# Altium project STM32F407_Board.PrjPcb
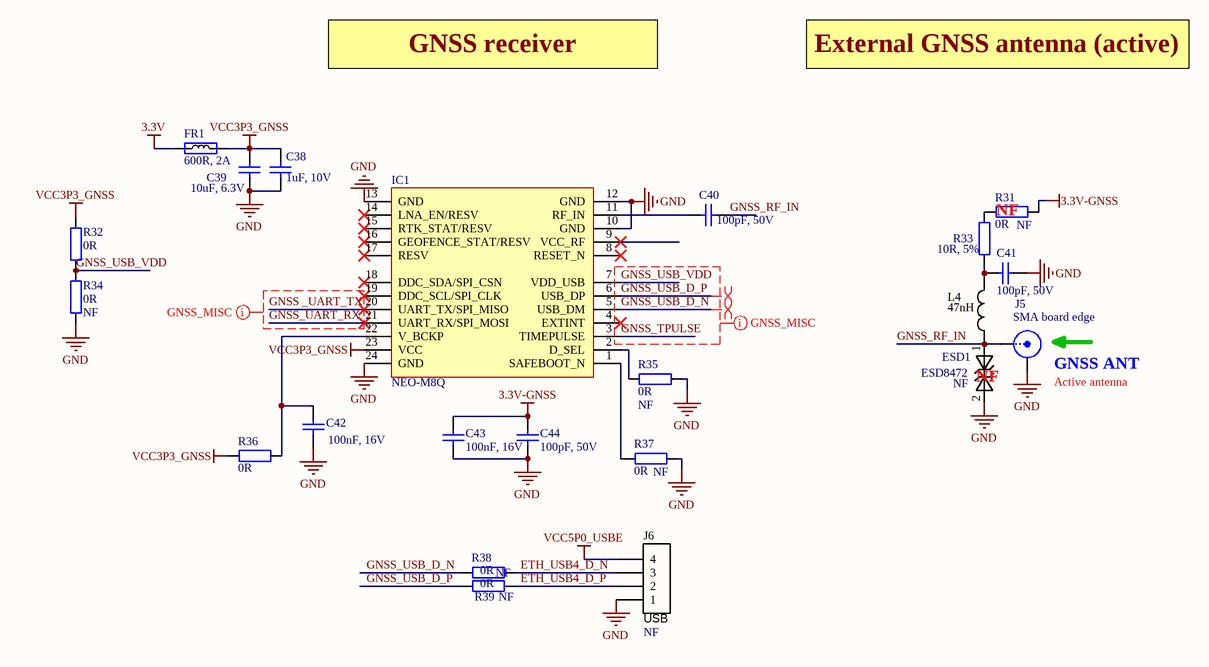
[diagram p0: GNSS-receiver.SchDoc]
5 sheets, 80 parts. Net scope: global (net labels, ports and power ports of the same name join across sheets).
Board file: CORE-XY.PcbDoc
Sheets:
  GNSS-receiver.SchDoc
  sensors.SchDoc
  INTERFACE-COMMUNICATION.SchDoc
  LORA-MODULE.SchDoc
  DAC4-20mA-ADC-0-10V.SchDoc

## Sheet GNSS-receiver.SchDoc
size A4

### Parts
C38  1uF, 10V  [CAP0402]
C39  10uF, 6.3V  [CAP0603]
C40  100pF, 50V  [CAP0402]
C41  100pF, 50V  [CAP0402]
C42  100nF, 16V  [CAP0402]
C43  100nF, 16V  [CAP0402]
C44  100pF, 50V  [CAP0402]
ESD1  ESD8472  Assembly Info: NF  [ESD8472_X3DFN2]
FR1  600R, 2A  [RES0805]
IC1  NEO-M8Q  [NEO-7M/8M]
J5  SMA board edge  [SMA_connector_board_edge_SM]
J6  USB  Assembly Info: NF  [HEADER4X1_TH]
L4  47nH  [RES0402]
R31  0R  Assembly Info: NF  [RES0402]
R32  0R  [RES0402]
R33  10R, 5%  [RES0402]
R34  0R  Assembly Info: NF  [RES0402]
R35  0R  Assembly Info: NF  [RES0402]
R36  0R  [RES0402]
R37  0R  Assembly Info: NF  [RES0402]
R38  0R  Assembly Info: NF  [RES0402]
R39  0R  Assembly Info: NF  [RES0402]

### Nets
3.3V: FR1.1
3.3V-GNSS: C43.2 C44.1 R31.1
GND: C38.1 C39.1 C41.2 C42.2 C43.1 C44.2 ESD1.2 IC1.10(GND) IC1.12(GND) IC1.13(GND) IC1.24(GND) J5.2(Y) J6.1 R34.2 R35.2 R37.1
VCC3P3_GNSS: C38.2 C39.2 FR1.2 IC1.23(VCC) R32.2 R36.2
VCC5P0_USBE: J6.4
ETH_USB4_D_N: J6.3 R38.1
ETH_USB4_D_P: J6.2 R39.1
GNSS _UART_TX: IC1.20(UART_TX/SPI_MISO)
GNSS_RF_IN: C40.1 ESD1.1 J5.1(X) L4.1
GNSS_TPULSE: IC1.3(TIMEPULSE)
GNSS_UART_RX: IC1.21(UART_RX/SPI_MOSI)
GNSS_USB_D_N: IC1.5(USB_DM) R38.2
GNSS_USB_D_P: IC1.6(USB_DP) R39.2
GNSS_USB_VDD: IC1.7(VDD_USB) R32.1 R34.1
NetC40_2: C40.2 IC1.11(RF_IN)
NetC41_1: C41.1 L4.2 R33.2
NetC42_1: C42.1 IC1.22(V_BCKP) R36.1
NetIC1_1: IC1.1(SAFEBOOT_N) R37.2
NetIC1_2: IC1.2(D_SEL) R35.1
NetR31_2: R31.2 R33.1

Not connected (* = marked no-connect by the designer): IC1 4(EXTINT)* 8(RESET_N)* 9(VCC_RF)* 14(LNA_EN/RESV)* 15(RTK_STAT/RESV)* 16(GEOFENCE_STAT/RESV)* 17(RESV)* 18(DDC_SDA/SPI_CSN)* 19(DDC_SCL/SPI_CLK)*

### Layout directives
differential pair: GNSS_USB_D_N, GNSS_USB_D_P
net class GNSS_MISC: GNSS _UART_TX, GNSS_TPULSE, GNSS_UART_RX, GNSS_USB_D_N, GNSS_USB_D_P, GNSS_USB_VDD

### Notes on the sheet
- GNSS receiver
- External GNSS antenna (active)
- NF
- (near ESD1) NF
- (near J5) GNSS ANT
- (near J5) Active antenna

### Library data of the parts
C38 = Cap_0402: CAP CER 1UF 10V X5R 0402; Manufacturer: Yageo; Part Description: 1µF 10V Ceramic Capacitor X5R 0402 (1005 Metric) 0.039" L x 0.020" W (1.00mm x 0.50mm); Manufacturer Part Number 1: CC0402MRX5R6BB105; Notification: Current market demand for these product types have resulted in fluctuating and extending lead times. Lead times may differ.; Tolerance: ±20%; Value: 1uF, 10V; Supplier 1: Digi-Key; Supplier Part Number 1: 311-1732-1-ND; RoHS: RoHS Compliant; Applications: General Purpose; Category: Capacitors; ComponentLink1Description: http://www.yageo.com/documents/recent/UPY-GPHC_X5R_4V-to-50V_25.pdf; ComponentLink1URL: http://www.yageo.com/documents/recent/UPY-GPHC_X5R_4V-to-50V_25.pdf; Failure Rate: -; Features: -; Height - Seated (Max): -; Lead Spacing: -; Lead Style: -; Mounting Type: Surface Mount, MLCC; Operating Temperature: -55°C ~ 85°C; Package / Case: 0402 (1005 Metric); Packaging: Cut Tape (CT); Part Status: Active; Pricing 1: 1=0.22, 10=0.156, 100=0.0732, 500=0.0513, 1000=0.04248, 2500=0.03953, 5000=0.03617 (USD); Ratings: -; Size / Dimension: 0.039" L x 0.020" W (1.00mm x 0.50mm); Stock 1: 69600; Temperature Coefficient: X5R; Thickness (Max): 0.022" (0.55mm); Voltage - Rated: 10V
C39 = Cap_0603: Manufacturer Part Number 1: CC0603MRX5R5BB106; Manufacturer: Yageo; Part Description: 10µF ±20% 6.3V X5R Ceramic Capacitor -55°C ~ 85°C Surface Mount, MLCC 0603 (1608 Metric) 0.063" L x 0.031" W (1.60mm x 0.80mm); Capacitance: 10µF; Tolerance: ±20%; Supplier 1: Digi-Key; Supplier Part Number 1: 311-1448-2-ND; Package / Case: 0603 (1608 Metric); Category: Capacitors; Voltage - Rated: 6.3V; Value: 10uF, 6.3V
C40 C41 C44 = Cap_0402: Manufacturer Part Number 1: CC0402JRNPO9BN101; Manufacturer: Yageo; Part Description: 100pF ±5% 50V C0G, NP0 Ceramic Capacitor -55°C ~ 125°C Surface Mount, MLCC 0402 (1005 Metric) 0.039" L x 0.020" W (1.00mm x 0.50mm); Tolerance: ±5%; Temperature Coefficient: C0G, NP0; Value: 100pF, 50V; Capacitance: 100pF; Thickness (Max): 0.022" (0.55mm); Size / Dimension: 0.039" L x 0.020" W (1.00mm x 0.50mm); RoHS: RoHS Compliant; Ratings: -; Package / Case: 0402 (1005 Metric); Mounting Type: Surface Mount, MLCC; Height - Seated (Max): -; Features: -; Lead Spacing: -; Voltage - Rated: 50V; Operating Temperature: -55°C ~ 125°C; Packaging: Cut Tape (CT); Applications: General Purpose; Lead Style: -; Supplier 1: Digi-Key; Category: Capacitors; Supplier Part Number 1: 311-1024-1-ND
C42 = Cap_0603: Manufacturer Part Number 1: GRM155R71C104KA88D; Part Description: CAP CER 0.1UF 16V X7R 0402; Brand: Murata Electronics; Tolerance: 10 %; Type: General Purpose MLCC; Capacitance: 0.1 uF; Temperature Coefficient / Code: +/- 15 %; Case Height: 0.5 mm; Case Length: 1 mm; Dielectric: X7R; Supplier 1: Mouser; Supplier Part Number 1: 81-GRM155R71C104KA88; Case Code - in: 0402; Manufacturer: Murata Electronics; Category: Multilayer Ceramic Capacitors MLCC - SMD/SMT; Voltage Rating DC: 16 V; Value: 100nF, 16V; Manufacturer Part Number: GRM155R71C104KA88D; Case Code - mm: 1005; Case Width: 0.5 mm; Maximum Operating Temperature: + 125 C; Minimum Operating Temperature: - 55 C; Minimum Order Quantity: 1; Operating Temperature Range: - 55 C to + 125 C; Package / Case: 0402 (1005 metric); Packaging: Reel; Product: General Type MLCCs; Product Category: Low & Medium Capacitance SMD Ceramic Chip Capacitors; Reeling: True; RoHS - Mouser: Y; RoHS: RoHS Compliant; Series: GRM; Standard Pack Qty: 10000; Termination Style: SMD/SMT
C43 = Cap_0402: Manufacturer: Murata Electronics; Manufacturer Part Number: GRM155R71C104KA88D; Part Description: CAP CER 0.1UF 16V X7R 0402; Tolerance: 10 %; Type: General Purpose MLCC; Capacitance: 0.1 uF; Case Length: 1 mm; Dielectric: X7R; Case Height: 0.5 mm; Temperature Coefficient / Code: +/- 15 %; Value: 100nF, 16V; Supplier 1: Mouser; Supplier Part Number 1: 81-GRM155R71C104KA88; Case Code - in: 0402; RoHS: RoHS Compliant; Operating Temperature Range: - 55 C to + 125 C; Series: GRM; Termination Style: SMD/SMT; Package / Case: 0402 (1005 metric); Voltage Rating DC: 16 V; Maximum Operating Temperature: + 125 C; Case Code - mm: 1005; Minimum Operating Temperature: - 55 C; Product Category: Low & Medium Capacitance SMD Ceramic Chip Capacitors; Packaging: Reel; Product: General Type MLCCs; Category: Multilayer Ceramic Capacitors MLCC - SMD/SMT; Brand: Murata Electronics; Case Width: 0.5 mm; RoHS - Mouser: Y; Standard Pack Qty: 10000; Minimum Order Quantity: 1; Reeling: True; Manufacturer Part Number 1: GRM155R71C104KA88D
ESD1 = ESD8472: Manufacturer: ON Semiconductor; Manufacturer Part Number 1: ESD8472MUT5G; Part Description: TVS DIODE 5.3VWM 14VC X3DFN2; Voltage - Reverse Standoff (Typ): 5.3V (Max); Voltage - Breakdown (Min): 7V; Voltage - Clamping (Max) @ Ipp: 14V; Current - Peak Pulse (10/1000µs): 3A (8/20µs); Power Line Protection: No; Capacitance @ Frequency: 0.2pF @ 1MHz; Supplier 1: Digi-Key; RoHS: RoHS Compliant; Category: Circuit Protection; Stock 1: 2295; Pricing 1: 1=0.39, 10=0.315, 100=0.2142, 500=0.16068, 1000=0.12051 (USD); Packaging: Cut Tape (CT); Part Status: Active; Type: Zener; Power - Peak Pulse: -; Applications: Automotive, RF Antenna; Operating Temperature: -55°C ~ 150°C (TJ); Mounting Type: Surface Mount; Package / Case: 2-XFDFN; Supplier Device Package: 2-X3DFN (0.62x0.32); ComponentLink1URL: http://www.onsemi.com/pub/Collateral/ESD8472-D.PDF; ComponentLink1Description: http://www.onsemi.com/pub/Collateral/ESD8472-D.PDF; Supplier Part Number 1: ESD8472MUT5GOSCT-ND
FR1 = Ferrite: Manufacturer Part Number 1: MPZ2012S601AT000; Manufacturer: TDK Corporation; Part Description: FERRITE BEAD 600 OHM 0805 1LN; DC Resistance (DCR): 100 mOhm Max; Filter Type: Differential Mode - Single; Impedance @ Frequency: 600 Ohm @ 100MHz; Supplier 1: Digi-Key; Supplier Part Number 1: 445-2206-2-ND; Value: 600R, 2A; Category: Filters; Current Rating: 2A; Height (Max): 0.041" (1.05mm); Mounting Type: Surface Mount; Package / Case: 0805 (2012 Metric); Packaging: Tape & Reel (TR); RoHS: RoHS Compliant; Size / Dimension: 0.079" L x 0.049" W (2.00mm x 1.25mm)
IC1 = NEO-M8P_M8M: GNSS engine for GPS/QZSS, GLONASS; Manufacturer: u-blox; Manufacturer Part Number: NEO-M8Q-0; ComponentLink1URL: https://www.u-blox.com/en/product/neo-7-series; ComponentLink2Description: Datasheet; ComponentLink1Description: https://www.u-blox.com/en/product/neo-7-series; ComponentLink3URL: https://www.u-blox.com/sites/default/files/NEO-M8-FW3_DataSheet_(UBX-15031086).pdf; ComponentLink3Description: https://www.u-blox.com/sites/default/files/NEO-M8-FW3_DataSheet_(UBX-15031086).pdf; Supplier 1: Digi-Key; Supplier Part Number 1: 672-1009-1-ND; Stock 1: 5505; Pricing 1: 1=25, 10=20.244, 50=16.6216, 100=13.314 (USD); Value: NEO-M8Q
J5 = RF_IF_connector: CONN SMA JACK STR 50OHM EDGE MNT; Manufacturer: RF Solutions; Manufacturer Part Number 1: CON-SMA-EDGE-S; Part Description: SMA Connector Jack, Female Socket Board Edge, End Launch Solder; Connector Type: Jack, Female Socket; Contact Termination: Solder; Supplier 1: Digi-Key; Supplier Part Number 1: CON-SMA-EDGE-S-ND; RoHS: RoHS Compliant; Category: Connectors, Interconnects; Stock 1: 1751; Pricing 1: 1=2.1 (USD); Packaging: -; Part Status: Active; Connector Style: SMA; Shield Termination: Solder; Impedance: -; Mounting Type: Board Edge, End Launch; Mounting Feature: -; Cable Group: -; Fastening Type: Threaded; Frequency - Max: -; Features: -; Housing Color: -; Ingress Protection: -; Includes: -; Body Material: -; Body Finish: -; Center Contact Plating: -; Dielectric Material: -; Operating Temperature: -; Center Contact Material: -; Voltage Rating: -; Mating Cycles: -; Insertion Loss: -; ComponentLink1URL: http://media.digikey.com/pdf/Data%20Sheets/RF%20Solutions%20PDFs/CON-SMA-EDGE.pdf; ComponentLink1Description: http://media.digikey.com/pdf/Data%20Sheets/RF%20Solutions%20PDFs/CON-SMA-EDGE.pdf
J6 = Header4P: Header, 4-pin; Part Description: 4 Positions Header Connector 0.100" (2.54mm) Through Hole Gold; Manufacturer: Wurth Electronics Inc.; Manufacturer Part Number 1: 61300411121; Pitch - Mating: 0.100" (2.54mm); Number of Positions: 4; Number of Positions Loaded: All; Style: Board to Board or Cable; Shrouding: Unshrouded; Contact Length - Mating: 0.236" (6.00mm); Contact Length - Post: 0.118" (3.00mm); Overall Contact Length: 0.454" (11.54mm); Material Flammability Rating: UL94 V-0; Current Rating: 3A; Voltage Rating: 250V; Supplier 1: Digi-Key; Supplier Part Number 1: 732-5317-ND; RoHS: RoHS Compliant; Category: Connectors, Interconnects; Stock 1: 25204; Pricing 1: 1=0.18, 10=0.153, 25=0.1272, 50=0.106, 100=0.096, 1000=0.088 (USD); Packaging: Bulk; Part Status: Active; Connector Type: Header; Contact Type: Male Pin; Number of Rows: 1; Row Spacing - Mating: -; Mounting Type: Through Hole; Termination: Solder; Fastening Type: Push-Pull; Insulation Height: 0.100" (2.54mm); Contact Shape: Square; Contact Finish - Mating: Gold; Contact Finish Thickness - Mating: -; Contact Finish - Post: -; Contact Material: Copper Alloy; Insulation Material: Polybutylene Terephthalate (PBT); Features: -; Operating Temperature: -40°C ~ 125°C; Ingress Protection: -; Insulation Color: Black; Mated Stacking Heights: -; Contact Finish Thickness - Post: -; Applications: -; ComponentLink1URL: http://katalog.we-online.de/em/datasheet/6130xx11121.pdf; ComponentLink1Description: http://katalog.we-online.de/em/datasheet/6130xx11121.pdf
L4 = Inductor_0603: Manufacturer: COILCRAFT; Manufacturer Part Number: 0402HP-47NXJLU; Part Description: COILCRAFT  0402HP-47NXJLU  Surface Mount High Frequency Inductor, 0402HP Series, 47 nH, 420 mA, 0402 [1005 Metric], Wirewound; SVHC: No SVHC (15-Jun-2015); Inductance Tolerance: ± 5%; High Frequency Inductor Case: 0402 [1005 Metric]; Inductor Case Style: 0402 [1005 Metric]<!--FANDB--><div class="features-and-benefits-container"></div>; Inductance: 47; DC Resistance Max: 0.58; Self Resonant Frequency Min: 2.4; Product Range: 0402; DC Current Rating: 420; Inductor Construction: Wirewound; Supplier 1: Farnell; Supplier Part Number 1: 2285856; Packaging: Cut Tape; RoHS: Y-EX; value: 47nH; Manufacturer Part Number 1: 0402HP-47NXJLU
R31 R32 R34 R36 R37 = Res_0402: Manufacturer Part Number 1: RC0402JR-070RL; Manufacturer: Yageo; Part Description: RES SMD 0.0OHM JUMPER 1/16W 0402; Resistance (Ohms): 0.0; Tolerance: Jumper; Power (Watts): 0.063W, 1/16W; Value: 0R; Supplier 1: Digi-Key; Supplier Part Number 1: 311-0.0JRTR-ND; Category: Resistors; Temperature Coefficient: -; Features: Moisture Resistant; Supplier Device Package: 0402; Height: 0.016" (0.40mm); Package / Case: 0402 (1005 Metric); Operating Temperature: -55°C ~ 155°C; Size / Dimension: 0.039" L x 0.020" W (1.00mm x 0.50mm); Composition: Thick Film; Packaging: Tape & Reel (TR); Number of Terminations: 2; RoHS: RoHS Compliant
R33 = Res_0402: Manufacturer Part Number 1: RC0402JR-0710RL; Manufacturer: Yageo; Part Description: RES SMD 10 OHM 5% 1/16W 0402; Power (Watts): 0.063W, 1/16W; Resistance (Ohms): 10; Temperature Coefficient: ±200ppm/°C; Value: 10R, 5%; Supplier 1: Digi-Key; Supplier Part Number 1: 311-10JRTR-ND; Number of Terminations: 2; Height: 0.016" (0.40mm); RoHS: RoHS Compliant; Composition: Thick Film; Packaging: Tape & Reel (TR); Category: Resistors; Supplier Device Package: 0402; Features: Moisture Resistant; Tolerance: ±5%; Operating Temperature: -55°C ~ 155°C; Size / Dimension: 0.039" L x 0.020" W (1.00mm x 0.50mm); Package / Case: 0402 (1005 Metric)
R35 = Res_0402_1: Manufacturer Part Number 1: RC0402JR-070RL; Manufacturer: Yageo; Part Description: RES SMD 0.0OHM JUMPER 1/16W 0402; Resistance (Ohms): 0.0; Tolerance: Jumper; Power (Watts): 0.063W, 1/16W; Value: 0R; Supplier 1: Digi-Key; Supplier Part Number 1: 311-0.0JRTR-ND; Category: Resistors; Temperature Coefficient: -; Features: Moisture Resistant; Supplier Device Package: 0402; Height: 0.016" (0.40mm); Package / Case: 0402 (1005 Metric); Operating Temperature: -55°C ~ 155°C; Size / Dimension: 0.039" L x 0.020" W (1.00mm x 0.50mm); Composition: Thick Film; Packaging: Tape & Reel (TR); Number of Terminations: 2; RoHS: RoHS Compliant
R38 R39 = Res_0402: Manufacturer: Yageo; Part Description: RES SMD 0.0OHM JUMPER 1/16W 0402; Manufacturer Part Number 1: RC0402JR-070RL; Power (Watts): 0.063W, 1/16W; Resistance (Ohms): 0.0; Tolerance: Jumper; Supplier 1: Digi-Key; Supplier Part Number 1: 311-0.0JRTR-ND; Composition: Thick Film; Package / Case: 0402 (1005 Metric); Category: Resistors; Value: 0R; Features: Moisture Resistant; Height: 0.016" (0.40mm); Number of Terminations: 2; Operating Temperature: -55°C ~ 155°C; Packaging: Tape & Reel (TR); RoHS: RoHS Compliant; Size / Dimension: 0.039" L x 0.020" W (1.00mm x 0.50mm); Supplier Device Package: 0402; Temperature Coefficient: -

## Sheet sensors.SchDoc
size A4
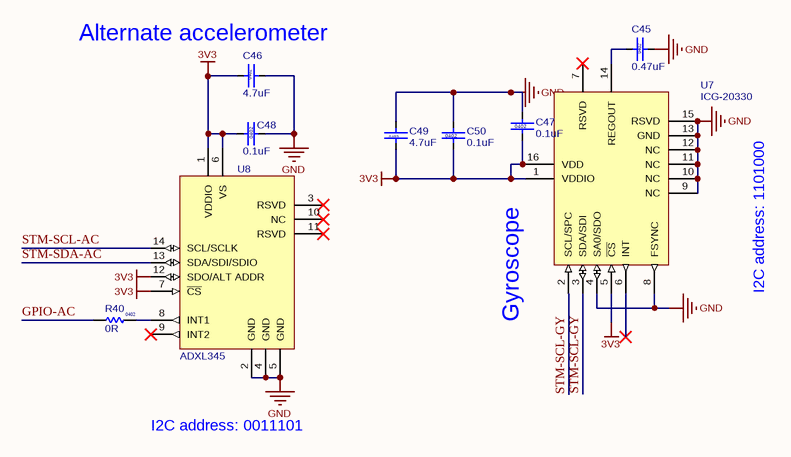
[diagram p1: sensors.SchDoc]

### Parts
C45  value 0.47uF  Size: 0402  [Cap 0402 HD]
C46  value 4.7uF  Size: 0402  [Cap 0402 HD]
C47  value 0.1uF  Size: 0402  [Cap 0402 HD]  (hidden comment: 120-000160.1uF)
C48  value 0.1uF  Size: 0402  [Cap 0402 HD]  (hidden comment: 120-000160.1uF)
C49  value 4.7uF  Size: 0402  [Cap 0402 HD]
C50  value 0.1uF  Size: 0402  [Cap 0402 HD]  (hidden comment: 120-000160.1uF)
R40  value 0R  Size: 0402  [RES 0402 HD]
U7  (no value)  [ICG-20330]
U8  (no value)  [ADXL345]

### Nets
3V3: C46.1 C47.1 C48.1 C49.1 C50.1 U7.1(VDDIO) U7.5(~{CS}) U7.16(VDD) U8.1(VDDIO) U8.6(VS) U8.7(~{CS}) U8.12(SDO/ALT_ADDR)
GND: C45.2 C46.2 C47.2 C48.2 C49.2 C50.2 U7.4(SA0/SDO) U7.8(FSYNC) U7.9(NC) U7.10(NC) U7.11(NC) U7.12(NC) U7.13(GND) U7.15(RSVD) U8.2(GND) U8.4(GND) U8.5(GND)
GPIO-AC: R40.1
STM-SCL-AC: U8.14(SCL/SCLK)
STM-SCL-GY: U7.2(SCL/SPC) U7.3(SDA/SDI)
STM-SDA-AC: U8.13(SDA/SDI/SDIO)
NetC45_1: C45.1 U7.14(REGOUT)
NetR40_2: R40.2 U8.8(INT1)

Not connected (* = marked no-connect by the designer): U7 6(INT)* 7(RSVD)*; U8 3(RSVD)* 9(INT2)* 10(NC)* 11(RSVD)*

### Notes on the sheet
- (near C46) Alternate accelerometer
- (near U7) Gyroscope
- I2C address: 1101000
- I2C address: 0011101

### Library data of the parts
C45 = 120-00072: Cap, Ceramic, 0.47UF 10V 10% X5R 0402; Manufacturer 1: Murata Electronics North America; Manufacturer Part Number 1: GRM155R61A474KE15J; Part Name: CAP CER 0.47UF 10V 10% X5R 0402; Item Phase: In Production; Tolerance: +/- 10%; Use in new designs: Yes; UBX Code: None; Part Number: 120-00072; Supplier 1: Digi-Key; Supplier Part Number 1: 490-6305-1-ND; Manufacturer 2: Samsung Electro-Mechanics America, Inc; Manufacturer Part Number 2: CL05A474KP5NNNC; Supplier 2: Digi-Key; Supplier Part Number 2: 1276-1173-1-ND; Height: 0.55mm; Max Operating Temp: 85; Min Operating Temp: -55; Pins: 2; Revision: 0A; Temperature Coefficient: X5R; Voltage: 10V
C46 C49 = 120-00020: Cap, Ceramic 4.7uF 10V 20% X5R 0402; Manufacturer 1: Samsung Electro-Mechanics America, Inc; Manufacturer Part Number 1: CL05A475MP5NRNC; Part Name: CAP CER 4.7uF 10V 20% X5R 0402; Item Phase: In Production; Tolerance: +/- 20%; Use in new designs: Yes; UBX Code: None; Part Number: 120-00020; Supplier 1: Digi-Key; Supplier Part Number 1: 1276-1482-1-ND; Manufacturer 2: Yageo; Manufacturer Part Number 2: CC0402KRX5R6BB475; Supplier 2: Digi-Key; Supplier Part Number 2: 311-3477-1-ND; Height: 0.55mm; Max Operating Temp: 85; Min Operating Temp: -55; Pins: 2; Revision: 0C; Temperature Coefficient: X5R; Voltage: 10V
C47 C48 C50 = 120-00016: Cap, Ceramic 0.1uF 10V 10% X5R 0402; Part Name: CAP CER 0.1UF 10V 10% X5R 0402; Part_Type: Ceramic Capacitor; Manufacturer: Murata Electronics North America; Manufacturer P/N: GRM155R61A104KA01J; Item_Phase: Production; Component Mounting Type: SMT; Tolerance: +/- 10%; Use in new designs: Yes; Part Number: 120-00016; Revision: 0A; Supplier 1: Digi-Key; Supplier Part Number 1: 490-6297-1-ND; Manufacturer 2: Yageo; Manufacturer P/N 2: CC0402KRX5R6BB104; Supplier 2: Digi-Key; Supplier Part Number 2: 311-1336-1-ND; Arena Link: https://app.bom.com/a/GYHPV2L2L43KRMBK?v=spec.summary; Height: 0.55mm; Pins: 2; Temperature Coefficient: X5R; Voltage: 10V
R40 = 180-00020: Resistor 0 ohm 1/16W 0402; Manufacturer 1: Yageo; Manufacturer Part Number 1: RC0402FR-070RL; Part Name: RES SMD 0.0 OHM JUMPER 1/16W 0402; Item Phase: In Production; Tolerance: None; Use in new designs: Yes; Part Number: 180-00020; Supplier 1: Digi-Key; Supplier Part Number 1: 311-0.0LRCT-ND; Manufacturer 2: Hong Kong Resistors Manufactory; Manufacturer Part Number 2: RCT020RLF; Supplier 2: None; Supplier Part Number 2: None; Height: 0.40mm; Max Operating Temp: 155; Min Operating Temp: -55; Pins: 2; Power: 1/16W; Revision: 0E; Voltage: N/A; UBX Code: None
U7 = ICG-20330: SENSOR, Gyroscope, I2C, 3-AXIS, 1.7-3.45V, SMT, LGA-16, 3mmX3mm; Manufacturer 1: TDK InvenSense; Part Name: LIS3MDL; Body Size: 2mm x 2mm; Current: None; Item Phase: In Production; MFG Package: LGA-12; Use in new designs: Yes; Voltage: 1.9-3.6V; Part Number: ICG-20330; Manufacturer Part Number 1: ICG-20330; Height: 1mm; Max Operating Temp: 85; Min Operating Temp: -40; Pins: 12; Revision: 0A; UBX Code: None
U8 = ADXL345: SENSOR, ACCELEROMETER, 3-AXIS, I2C, SMT, +/-16g, LGA-14 3mmX5mm; Manufacturer 1: Analog Devices; Part Name: B39162B4353P810; Body Size: 1.4mm x 1.1mm; Current: None; Item Phase: In Production; MFG Package: QCS5P; Use in new designs: Yes; Part Number: ADXL345; Manufacturer Part Number 1: ADXL345; Height: 0.45mm; Max Operating Temp: 85; Min Operating Temp: -40; Pins: 5; Revision: 0A; Voltage: N/A; UBX Code: None

## Sheet INTERFACE-COMMUNICATION.SchDoc
size A4
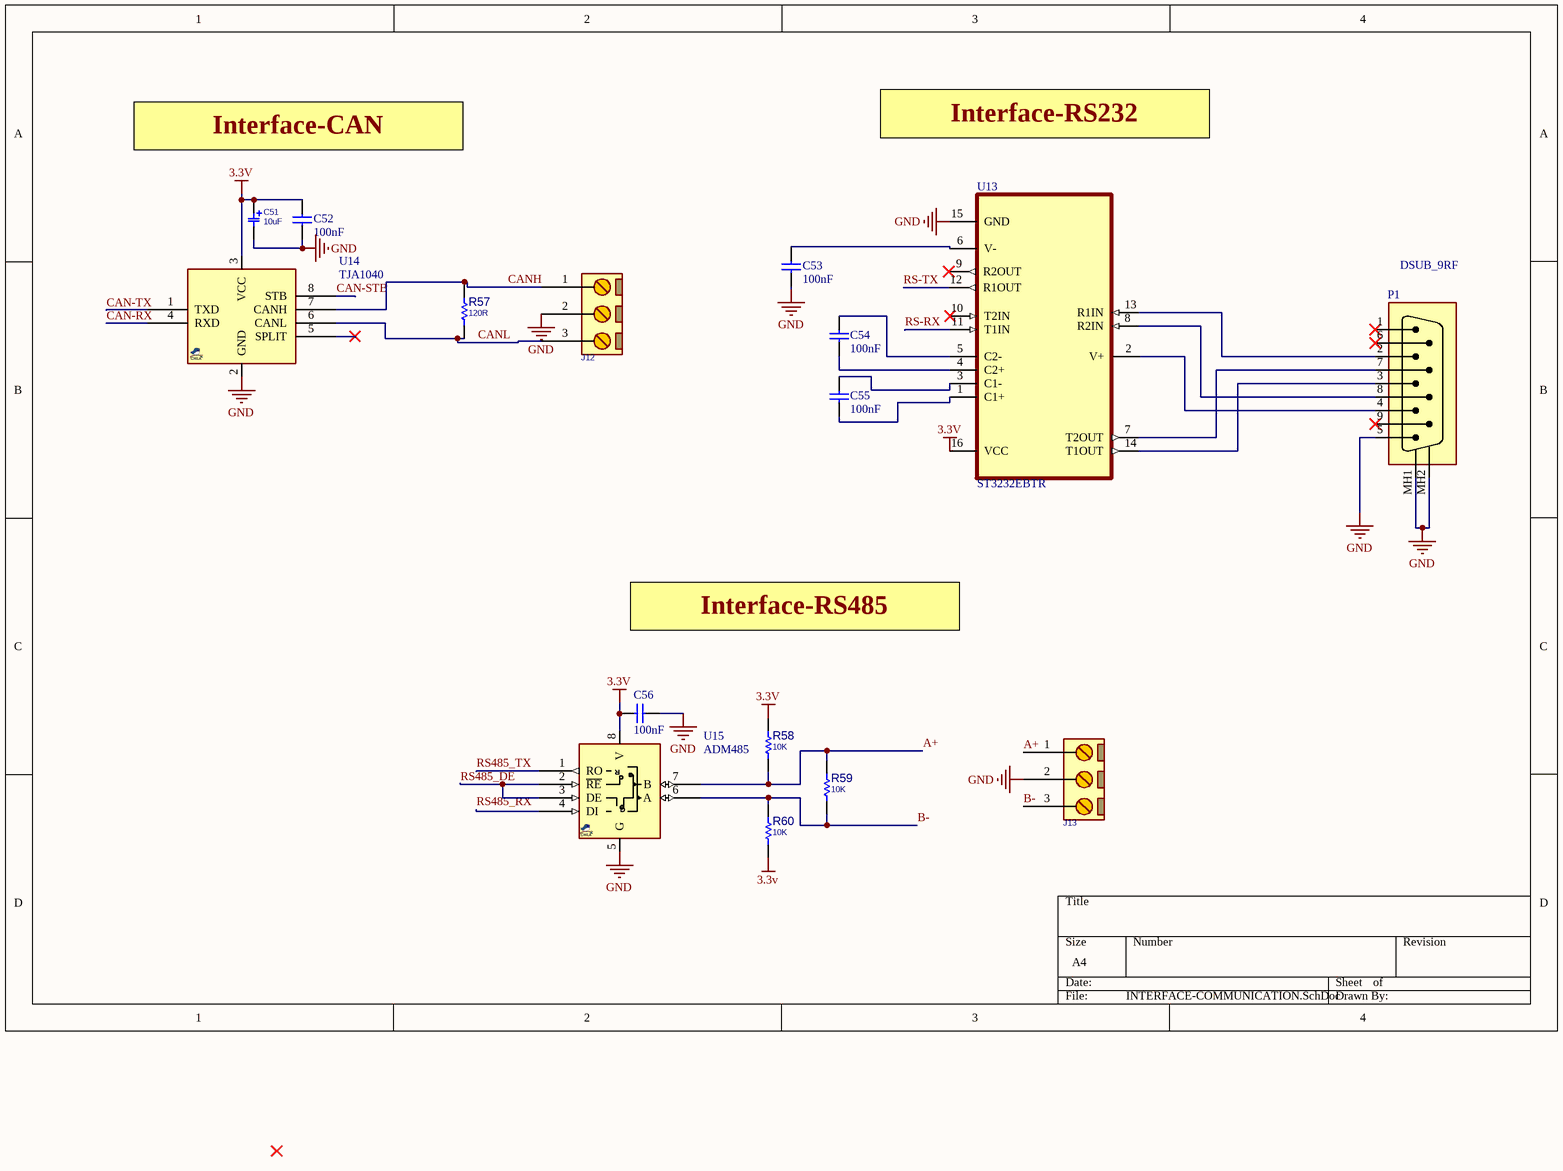
[diagram p2: INTERFACE-COMMUNICATION.SchDoc]

### Parts
C51  10uF  [C_TN_3216]
C52  100nF  [CAP0603]
C53  100nF  [CAP0603]
C54  100nF  [CAP0603]
C55  100nF  [CAP0603]
C56  100nF  [CAP0603]
J12  CONN_TB3  [MSTB_3]  (value not drawn)
J13  CONN_TB3  [MSTB_3]  (value not drawn)
P1  DSUB_9RF  [DSUB_9RF]
R57  120R  [R0402]
R58  10K  [R0402]
R59  10K  [R0402]
R60  10K  [R0402]
U13  ST3232EBTR  [SOP65P640X120-14N]
U14  TJA1040  [SO_8]
U15  ADM485  [SO_8]

### Nets
3.3V: C51.1 C52.1 C56.1 R58.2 R60.1 U13.16(VCC) U14.3(VCC) U15.8(V)
GND: C51.2 C52.2 C53.2 C56.2 J12.2 J13.2 P1.5 P1.MH1 P1.MH2 U13.15(GND) U14.2(GND) U15.5(G)
A+: J13.1 R58.1 R59.2 U15.7(B)
B-: J13.3 R59.1 R60.2 U15.6(A)
CAN-RX: U14.4(RXD)
CAN-STB: U14.8(STB)
CAN-TX: U14.1(TXD)
CANH: J12.1 R57.2 U14.7(CANH)
CANL: J12.3 R57.1 U14.6(CANL)
RS485_DE: U15.2(~{RE}) U15.3(DE)
RS485_RX: U15.4(DI)
RS485_TX: U15.1(RO)
RS-RX: U13.11(T1IN)
RS-TX: U13.12(R1OUT)
NetC53_1: C53.1 U13.6(V-)
NetC54_1: C54.1 U13.5(C2-)
NetC54_2: C54.2 U13.4(C2+)
NetC55_1: C55.1 U13.3(C1-)
NetC55_2: C55.2 U13.1(C1+)
NetP1_2: P1.2 U13.13(R1IN)
NetP1_3: P1.3 U13.14(T1OUT)
NetP1_4: P1.4 U13.2(V+)
NetP1_7: P1.7 U13.7(T2OUT)
NetP1_8: P1.8 U13.8(R2IN)

Not connected (* = marked no-connect by the designer): P1 1* 6* 9*; U13 9(R2OUT)* 10(T2IN)*; U14 5(SPLIT)*

### Notes on the sheet
- Interface-CAN
- Interface-RS232
- Interface-RS485
- (in symbol ADM485_SOP8) R; D

### Library data of the parts
C51 = CAP_SMD_TAN_10uF_10V: CAP, SMD, TAN; PARAM: 20%, 300mOhm, -55~105oC; MANF: VISHAY; MANF_P#: T55A106M010C0300; PARAM2: 10V; PRICE: 0.46$; VALUE: 10uF
C52-C56 = C0402-100n: 0.10µF 50V Ceramic Capacitor X7R 0603; Manufacturer Part Number: CL10B104KB8SFNC; Value: 100nF; Digi-Key Part Number: 1276-1936-1-ND
J12 J13 = CONN_MSTB_3: CONN, PHOENIX MSTB, 5-G, 5.08mm pitch; VALUE: CONN_TB3
P1 = CONN_DSUB_9RF: CONN, DSUB, HD, 9PIN, R/A, FEMALE, THD; MANF_P#: -; MANF: -; VALUE: DSUB_9RF
R57-R60 = RES_SMD: RESISTOR, SMD; PARAM: 0.063W; DESC: DESCRIPTION; DIST#: MOUSER; PARAM2: 1%; MANF_P#: -; MANF: -; ASSEMBLY: ASSEMBLY; PRICE: 100= 0.5$
  R57: VALUE: 120R
  R58-R60: VALUE: 10K
U13 = ST3232EBTR: 2/2 Transceiver Full RS232 16-TSSOP; MF: STMicroelectronics; SnapEDA_Link: https://www.snapeda.com/parts/ST3232EBTR/STMicroelectronics/view-part/?ref=snap; Availability: In Stock; Purchase-URL: https://pricing.snapeda.com/search/part/ST3232EBTR/?ref=eda; MP: ST3232EBTR; Value: *; Price: None; Package: TSSOP-16 STMicroelectronics; Check_prices: https://www.snapeda.com/parts/ST3232EBTR/STMicroelectronics/view-part/?ref=eda
U14 = TJA1040_SOP8: CAN, phy, High speed, 5V (VDD); MANF: NXP; MANF_P#: TJA1040T; PRICE: 4000toman@PAYA; PARAM2: 5V (VDD); PARAM: PARAM; VALUE: TJA1040
U15 = ADM485_SOP8: RS-485 Transceiver, 5V, SOP-8, ±7V Ground Difference Between Devices on the Bus; MANF_P#: ADM485AR; MANF: Analog Devices; PRICE: 4000toman@PAYA; VALUE: ADM485

## Sheet LORA-MODULE.SchDoc
size A
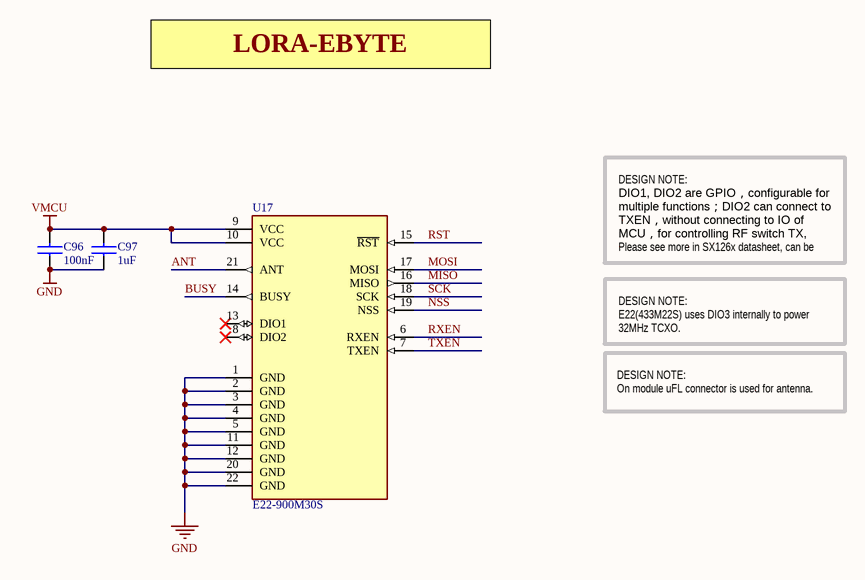
[diagram p3: LORA-MODULE.SchDoc]

### Parts
C96  100nF  [CAP0603]
C97  1uF  [CAP0603]
U17  E22-900M30S  [E22-900M30S]

### Nets
GND: C96.1 C97.1 U17.1(GND) U17.2(GND) U17.3(GND) U17.4(GND) U17.5(GND) U17.11(GND) U17.12(GND) U17.20(GND) U17.22(GND)
VMCU: C96.2 C97.2 U17.9(VCC) U17.10(VCC)
ANT: U17.21(ANT)
BUSY: U17.14(BUSY)
MISO: U17.16(MISO)
MOSI: U17.17(MOSI)
NSS: U17.19(NSS)
RST: U17.15(~{RST})
RXEN: U17.6(RXEN)
SCK: U17.18(SCK)
TXEN: U17.7(TXEN)

Not connected (* = marked no-connect by the designer): U17 8(DIO2)* 13(DIO1)*

### Notes on the sheet
- LORA-EBYTE
- DESIGN NOTE:
  DIO1, DIO2 are GPIO，configurable for multiple functions；DIO2 can connect to TXEN，without connecting to IO of MCU，for controlling RF switch TX, Please see more in SX126x datasheet, can be floated when free.
- DESIGN NOTE:
  E22(433M22S) uses DIO3 internally to power 32MHz TCXO.
- DESIGN NOTE:
  On module uFL connector is used for antenna.

### Library data of the parts
C96 = C - 100nF: MURATA - GRM188R71C104KA01J - CAP, MLCC, X7R, 0.1UF, 16V, 0603; IRNAS Part No.: I-200005; Ceramic Capacitor Case: 0603 [1608 Metric]; Capacitance: 0.1; Voltage Rating: 16; Capacitance Tolerance: ± 10%; Dielectric Characteristic: X7; Product Range: GRM Series; SVHC: No SVHC (20-Jun-2016; Supplier 1: Farnell; Manufacturer: MURATA; Manufacturer Part Number: GRM188R71C104KA01J; RoHS: YES; Stock 1: 18297; Pricing 1: 10=0.0145, 100=0.0126, 500=0.0081, 2500=0.0059, 5000=0.0052, 10000=0.0046, 50000=0.0036, 100000=0.0035 (GBP); Packaging: Cut Tape; Operating Temperature Min: -55; Operating Temperature Max: 125; Automotive Qualification Standard: -; MSL: MSL 1 - Unlimited; ComponentLink1URL: http://www.farnell.com/datasheets/2189124.pdf; ComponentLink1Description: http://www.farnell.com/datasheets/2189124.pdf; Supplier Part Number 1: 2688519
C97 = C - 1uF: MURATA - GRM188R61H105KAALD - CAP, MLCC, X5R, 1UF, 50V, 0603; IRNAS Part No.: I-200006; Ceramic Capacitor Case: 0603 [1608 Metric]; Capacitance: 1; Voltage Rating: 50; Capacitance Tolerance: ± 10%; Dielectric Characteristic: X5; Product Range: GRM Series; SVHC: No SVHC (17-Dec-2015); Capacitor Terminals: SMD<!--FANDB--><div class="features-and-benefits-container"><div class="features-and-benefits-description"><span class="features-benefits-value">The Murata GRM series capacitors are Multilayer Ceramic Chip Capacitors (MLCC) used for general purpose applications. These MLCC capacitors are classified into temperature compensating and high dielectric constant types depending on the change in electrostatic capacitance due to change in temperature. The temperature compensating capacitors feature a small rate of change in electrostatic capacitance as the temperature changes and are used for applications such as filters and high frequency circuit matching. The high dielectric constant capacitors use materials with a high dielectric constant and feature a large electrostatic capacitance. Typical applications are power supply decoupling and smoothing circuits.</span></div><div class="features-and-benefits-list"><ul class="features-and-benefits-list-list"><li class="features-and-benefits-list-item">Large capacity and small size in a multilayer structure</li><li class="features-and-benefits-list-item">Capacitance value ranging from 0.1pF to 220?F</li><li class="features-and-benefits-list-item">Tin plated external electrodes, excellent solderability</li><li class="features-and-benefits-list-item">Provides good high frequency characteristics</li><li class="features-and-benefits-list-item">Excellent pulse response</li><li class="features-and-benefits-list-item">High reliability</li><li class="features-and-benefits-list-item">Capacitor size varies from 0.4×0.2mm to 5.7×5.0mm</li><li class="features-and-benefits-list-item">Rated voltage of 2.5VDC to 3.15; Supplier 1: Farnell; Manufacturer: MURATA; Manufacturer Part Number: GRM188R61H105KAALD; RoHS: YES; Stock 1: 62682; Pricing 1: 10=0.093, 100=0.062, 500=0.0507, 1000=0.0465, 2000=0.0429, 4000=0.0399, 20000=0.0372, 40000=0.0365 (GBP); Packaging: Cut Tape; Operating Temperature Min: -55; Operating Temperature Max: 85; Automotive Qualification Standard: -; MSL: -; Capacitance Tolerance ±: ± 10%; ComponentLink1URL: http://www.farnell.com/datasheets/2048611.pdf; ComponentLink1Description: http://www.farnell.com/datasheets/2048611.pdf; Supplier Part Number 1: 1845736
U17 = E22-900M30S: SX1262 868/915 MHz 1w SPI LoRa Module; MF: EBYTE; Value: *; SnapEDA_Link: https://www.snapeda.com/parts/E22-900M30S/EBYTE/view-part/?ref=snap; Availability: Not in stock; Price: None; Check_prices: https://www.snapeda.com/parts/E22-900M30S/EBYTE/view-part/?ref=eda; Package: Package; MP: E22-900M30S

## Sheet DAC4-20mA-ADC-0-10V.SchDoc
size A
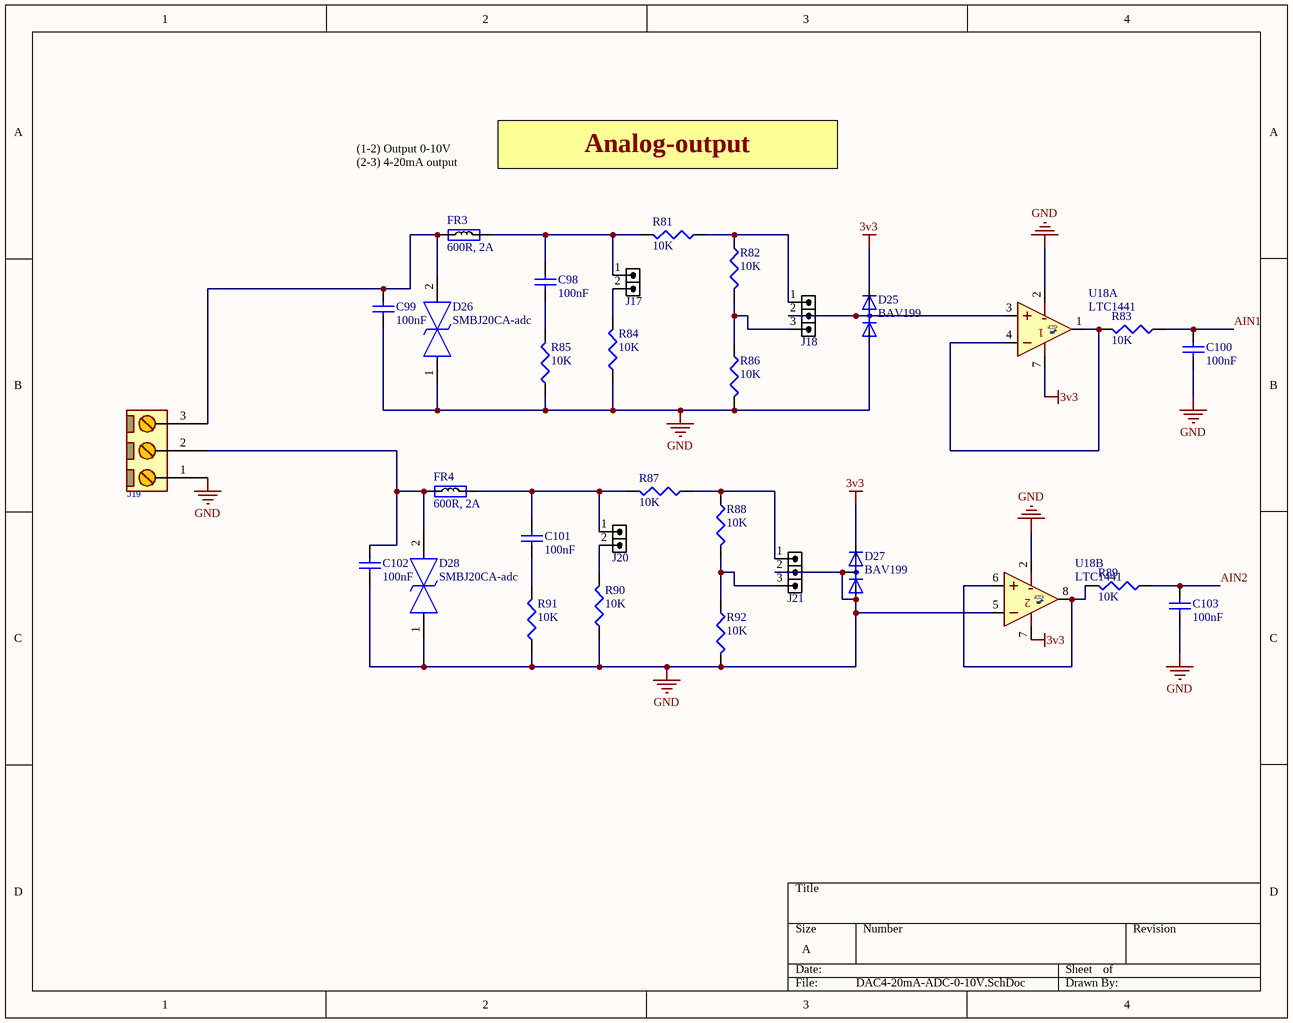
[diagram p4: DAC4-20mA-ADC-0-10V.SchDoc]

### Parts
C98  100nF  [c0603]
C99  100nF  [c0603]
C100  100nF  [c0603]
C101  100nF  [c0603]
C102  100nF  [c0603]
C103  100nF  [c0603]
D25  BAV199  [SOT323_3]
D26  SMBJ20CA-adc  [ESD_XDFN2]
D27  BAV199  [SOT323_3]
D28  SMBJ20CA-adc  [ESD_XDFN2]
FR3  600R, 2A  [RES0805]
FR4  600R, 2A  [RES0805]
J17  HDRM2  [HDR_M_1X2]  (value not drawn)
J18  HDRM3  [HDR_M_1X3]  (value not drawn)
J19  CONN_TB3  [MSTB_3]  (value not drawn)
J20  HDRM2  [HDR_M_1X2]  (value not drawn)
J21  HDRM3  [HDR_M_1X3]  (value not drawn)
R81  10K  [RES 0603_1608]
R82  10K  [RES 0603_1608]
R83  10K  [RES 0603_1608]
R84  10K  [RES 0603_1608]
R85  10K  [RES 0603_1608]
R86  10K  [RES 0603_1608]
R87  10K  [RES 0603_1608]
R88  10K  [RES 0603_1608]
R89  10K  [RES 0603_1608]
R90  10K  [RES 0603_1608]
R91  10K  [RES 0603_1608]
R92  10K  [RES 0603_1608]
U18  LTC1441  [SO_8]  (parts A,B of 2)

### Nets
3V3: D25.2(C) D27.2(C) U18.7(V+)
GND: C99.1 C100.1 C102.1 C103.1 D25.1(A) D26.1 D27.1(A) D27.3(AC) D28.1 J19.1 J21.2 R84.1 R85.1 R86.2 R90.1 R91.1 R92.2 U18.2(V-) U18.5(IN-)
AIN1: C100.2 R83.1
AIN2: C103.2 R89.1
NetC98_1: C98.1 R85.2
NetC98_2: C98.2 FR3.2 J17.1 R81.2
NetC99_2: C99.2 D26.2 FR3.1 J19.3
NetC101_1: C101.1 R91.2
NetC101_2: C101.2 FR4.2 J20.1 R87.2
NetC102_2: C102.2 D28.2 FR4.1 J19.2
NetD25_3: D25.3(AC) J18.2 U18.3(IN+)
NetJ17_2: J17.2 R84.2
NetJ18_1: J18.1 R81.1 R82.1
NetJ18_3: J18.3 R82.2 R86.1
NetJ20_2: J20.2 R90.2
NetJ21_1: J21.1 R87.1 R88.1
NetJ21_3: J21.3 R88.2 R92.1
NetR83_2: R83.2 U18.1(OUT) U18.4(IN-)
NetR89_2: R89.2 U18.6(IN+) U18.8(OUT)

### Notes on the sheet
- Analog-output
- (1-2) Output 0-10V
  (2-3) 4-20mA output

### Library data of the parts
C98-C103 = Cap Semi: 0.10µF 50V Ceramic Capacitor X7R 0603; Manufacturer Part Number: CL10B104KB8SFNC; Digi-Key Part Number: 1276-1936-1-ND; Value: 100nF
D25 D27 = BAV199: Diode Array 1 Pair Series Connection Standard 85V 140mA _DC_ Surface Mount TO-236-3, SC-59, SOT-23-3; MF: Diodes; Value: *; MP: BAV199; Package: SOT-23 Infineon; SnapEDA_Link: https://www.snapeda.com/parts/BAV199/Diodes%20Inc./view-part/193783/?ref=snap; Price: None; Availability: Unavailable
D26 D28 = SMBJ20CA-adc: TVS Diode (Bi-directional); Manufacturer_Name: onsemi; Datasheet Link: https://componentsearchengine.com/Datasheets/1/SMBJ20CA.pdf; Height: 2.45mm; Manufacturer_Part_Number: SMBJ20CA; Mouser Part Number: 512-SMBJ20CA; Mouser Price/Stock: https://www.mouser.co.uk/ProductDetail/onsemi-Fairchild/SMBJ20CA?qs=iN0KuJO79Ka3il%2FXEzRA3A%3D%3D; Arrow Part Number: SMBJ20CA; Arrow Price/Stock: https://www.arrow.com/en/products/smbj20ca/on-semiconductor
FR3 FR4 = Ferrite: as FR1 on sheet GNSS-receiver; Supplier 1: Digi-Key; Supplier Part Number 1: 445-2206-2-ND; Value: 600R, 2A; Category: Filters; Current Rating: 2A; Height (Max): 0.041" (1.05mm); Mounting Type: Surface Mount; Package / Case: 0805 (2012 Metric); Packaging: Tape & Reel (TR); RoHS: RoHS Compliant; Size / Dimension: 0.079" L x 0.049" W (2.00mm x 1.25mm)
J17 J20 = HDR_M_1X2: CONN, HEADER, Male, pitch: 2.54mm, 2POS; VALUE: HDRM2
J18 J21 = HDR_M_1X3: CONN, HEADER, Male, pitch: 2.54mm, 3POS; VALUE: HDRM3
J19 = CONN_MSTB_3: CONN, PHOENIX MSTB, 5-G, 5.08mm pitch; VALUE: CONN_TB3
R81-R92 = Res3_1: RES SMD 10K OHM 1% 1/10W 0603; Manufacturer Part Number: RC1608F103CS; Digi-Key Part Number: 1276-3485-1-ND; Value: 10K
U18 = LTC1441_SOP8: Comparator, Dual, Ultralow Power, with Reference; MANF: Linear Technology; MANF_P#: LTC1441CS8, LTC1441IS8; PARAM2: 2.7~16V, ±1.35~8V; VALUE: LTC1441

## Nets that join several sheets
3.3V: GNSS-receiver (FR1.1), INTERFACE-COMMUNICATION (8 pins)
3V3: sensors (12 pins), DAC4-20mA-ADC-0-10V (D25.2 D27.2 U18.7)
GND: GNSS-receiver (16 pins), sensors (17 pins), INTERFACE-COMMUNICATION (12 pins), LORA-MODULE (11 pins), DAC4-20mA-ADC-0-10V (19 pins)